# EAGLE design PowerPCB (EAGLE 9.4.2)
Assembly variants: basic, pinout

## Sheet 1 of 2: DC-DC converters
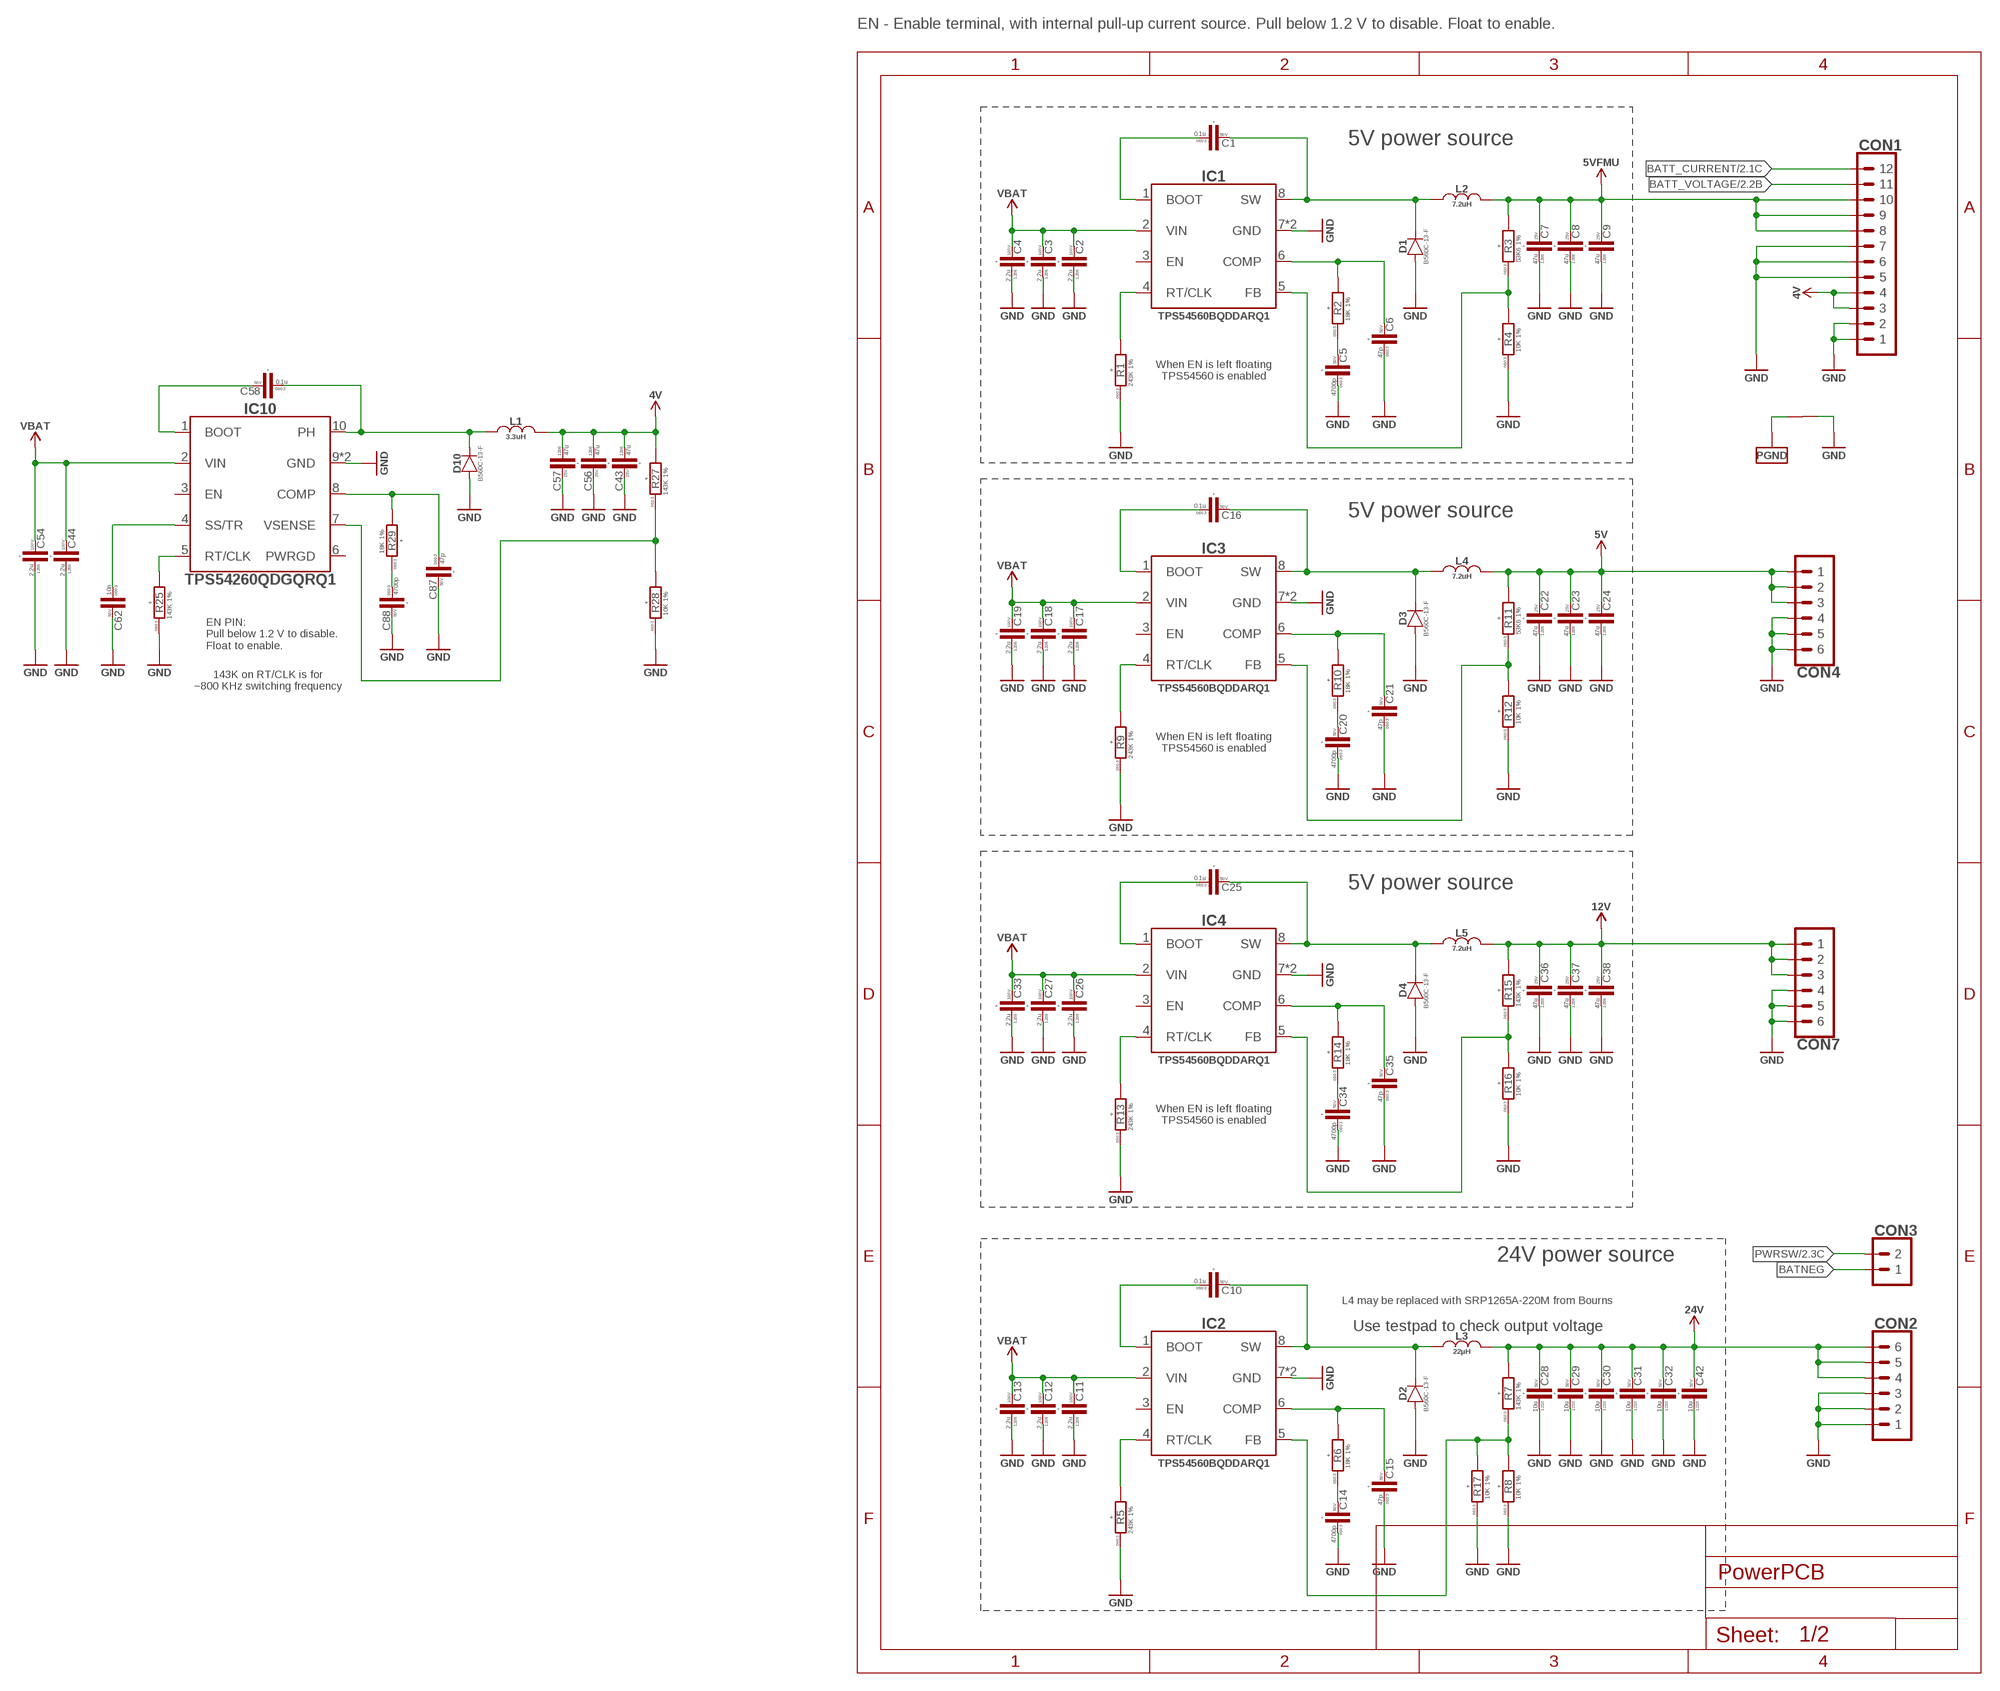
[diagram p0: schematic, sheet 1]

### Parts
C1  0.1u  C-0603  [C0603]
C2  2.2u  C-1206  [C1206]
C3  2.2u  C-1206  [C1206]
C4  2.2u  C-1206  [C1206]
C5  4700p  C-0603  [C0603]
C6  47p  C-0603  [C0603]
C7  47u  C-1206  [C1206]
C8  47u  C-1206  [C1206]
C9  47u  C-1206  [C1206]
C10  0.1u  C-0603  [C0603]
C11  2.2u  C-1206  [C1206]
C12  2.2u  C-1206  [C1206]
C13  2.2u  C-1206  [C1206]
C14  4700p  C-0603  [C0603]
C15  47p  C-0603  [C0603]
C16  0.1u  C-0603  [C0603]
C17  2.2u  C-1206  [C1206]
C18  2.2u  C-1206  [C1206]
C19  2.2u  C-1206  [C1206]
C20  4700p  C-0603  [C0603]
C21  47p  C-0603  [C0603]
C22  47u  C-1206  [C1206]
C23  47u  C-1206  [C1206]
C24  47u  C-1206  [C1206]
C25  0.1u  C-0603  [C0603]
C26  2.2u  C-1206  [C1206]
C27  2.2u  C-1206  [C1206]
C28  10u  C-1210  [C1210]
C29  10u  C-1210  [C1210]
C30  10u  C-1210  [C1210]
C31  10u  C-1210  [C1210]
C32  10u  C-1210  [C1210]
C33  2.2u  C-1206  [C1206]
C34  4700p  C-0603  [C0603]
C35  47p  C-0603  [C0603]
C36  47u  C-1206  [C1206]
C37  47u  C-1206  [C1206]
C38  47u  C-1206  [C1206]
C42  10u  C-1210  [C1210]
C43  47u  C-1206  [C1206]
C44  2.2u  C-1206  [C1206]
C54  2.2u  C-1206  [C1206]
C56  47u  C-1206  [C1206]
C57  47u  C-1206  [C1206]
C58  0.1u  C-0603  [C0603]
C62  10n  C-0603  [C0603]
C87  47p  C-0603  [C0603]
C88  4700p  C-0603  [C0603]
CON1  PINHEAD_1X12-2.54-FEMALE  [1X12-PTH-2.54-FEMALE]
CON2  PINHEAD_1X06-2.54-FEMALE  [1X06-PTH-2.54-FEMALE]
CON3  PINHEAD_1X02-2.54-FEMALE  [1X02-PTH-2.54-FEMALE]
CON4  PINHEAD_1X06-2.54-FEMALE  [1X06-PTH-2.54-FEMALE]
CON7  PINHEAD_1X06-2.54-FEMALE  [1X06-PTH-2.54-FEMALE]
D1  B560C  [DO-214AB(SMC)]
D2  B560C  [DO-214AB(SMC)]
D3  B560C  [DO-214AB(SMC)]
D4  B560C  [DO-214AB(SMC)]
D10  B560C  [DO-214AB(SMC)]
IC1  TPS54560B  [SOIC8-POWERPAD]
IC2  TPS54560B  [SOIC8-POWERPAD]
IC3  TPS54560B  [SOIC8-POWERPAD]
IC4  TPS54560B  [SOIC8-POWERPAD]
IC10  TPS54260  [MSOP10]
J1  CONNECTION-7MM  [CONNECTION_7MM]
L1  3.3uH  3.3µH-IHLP-202BZ  [IHLP-2020BZ-01]
L2  7.2uH  7.2µH-1064  [1064]
L3  22µH  22µH-SRP1265A  [SRP1265A]
L4  7.2uH  7.2µH-1064  [1064]
L5  7.2uH  7.2µH-1064  [1064]
R1  243K  R-1%-0603  [R0603]
R2  18K  R-1%-0603  [R0603]
R3  53K6  R-1%-0603  [R0603]
R4  10K  R-1%-0603  [R0603]
R5  243K  R-1%-0603  [R0603]
R6  18K  R-1%-0603  [R0603]
R7  143K  R-1%-0603  [R0603]
R8  10K  R-1%-0603  [R0603]
R9  243K  R-1%-0603  [R0603]
R10  18K  R-1%-0603  [R0603]
R11  53K6  R-1%-0603  [R0603]
R12  10K  R-1%-0603  [R0603]
R13  243K  R-1%-0603  [R0603]
R14  18K  R-1%-0603  [R0603]
R15  143K  R-1%-0603  [R0603]
R16  10K  R-1%-0603  [R0603]
R17  10K  R-1%-0603  [R0603]
R25  143K  R-1%-0603  [R0603]
R27  143K  R-1%-0603  [R0603]
R28  10K  R-1%-0603  [R0603]
R29  18K  R-1%-0603  [R0603]

### Nets
5VFMU: C7.P$2 C8.P$2 C9.P$2 CON1.8 CON1.9 CON1.10 L2.2 R3.2 ; also sheet 2
BATNEG: CON3.1 ; also sheet 2
BATT_CURRENT: CON1.12 ; also sheet 2
BATT_VOLTAGE: CON1.11 ; also sheet 2
BOOT: C58.2 IC10.1(BOOT)
BOOT1: C1.1 IC1.1(BOOT)
BOOT2: C16.1 IC3.1(BOOT)
BOOT3: C25.1 IC4.1(BOOT)
GND: C2.P$1 C3.P$1 C4.P$1 C5.1 C6.1 C7.P$1 C8.P$1 C9.P$1 C11.P$1 C12.P$1 C13.P$1 C14.1 C15.1 C17.P$1 C18.P$1 C19.P$1 C20.1 C21.1 C22.P$1 C23.P$1 C24.P$1 C26.P$1 C27.P$1 C28.1 C29.1 C30.1 C31.1 C32.1 C33.P$1 C34.1 C35.1 C36.P$1 C37.P$1 C38.P$1 C42.1 C43.P$2 C44.P$1 C54.P$1 C56.P$2 C57.P$2 C62.2 C87.2 C88.2 CON1.1 CON1.2 CON1.5 CON1.6 CON1.7 CON2.1 CON2.2 CON2.3 CON4.4 CON4.5 CON4.6 CON7.4 CON7.5 CON7.6 D1.A D2.A D3.A D4.A D10.A IC1.7(GND) IC1.P$1(GND) IC2.7(GND) IC2.P$1(GND) IC3.7(GND) IC3.P$1(GND) IC4.7(GND) IC4.P$1(GND) IC10.9(GND) IC10.EP(GND) J1.2 R1.1 R4.1 R5.1 R8.1 R9.1 R12.1 R13.1 R16.1 R17.1 R25.1 R28.1 ; also sheet 2
N$1: IC1.4(RT/CLK) R1.2
N$2: IC3.4(RT/CLK) R9.2
N$3: C6.2 IC1.6(COMP) R2.2
N$4: C5.2 R2.1
N$5: IC1.5(FB) R3.1 R4.2
N$6: C21.2 IC3.6(COMP) R10.2
N$7: C10.1 IC2.1(BOOT)
N$8: C10.2 D2.C IC2.8(SW) L3.1
N$9: IC2.4(RT/CLK) R5.2
N$10: C15.2 IC2.6(COMP) R6.2
N$11: C14.2 R6.1
N$12: IC2.5(FB) R7.1 R8.2 R17.2
N$13: C20.2 R10.1
N$14: IC4.4(RT/CLK) R13.2
N$15: IC3.5(FB) R11.1 R12.2
N$16: C35.2 IC4.6(COMP) R14.2
N$17: C34.2 R14.1
N$18: IC4.5(FB) R15.1 R16.2
N$20: C62.1 IC10.4(SS/TR)
N$38: C87.1 IC10.8(COMP) R29.2
N$39: IC10.5(RT/CLK) R25.2
N$50: C88.1 R29.1
PGND: J1.1 ; also sheet 2
PH: C58.1 D10.C IC10.10(PH) L1.P$1
PWRSW: CON3.2 ; also sheet 2
SW1: C1.2 D1.C IC1.8(SW) L2.1
SW2: C16.2 D3.C IC3.8(SW) L4.1
SW3: C25.2 D4.C IC4.8(SW) L5.1
VBAT [HV]: C2.P$2 C3.P$2 C4.P$2 C11.P$2 C12.P$2 C13.P$2 C17.P$2 C18.P$2 C19.P$2 C26.P$2 C27.P$2 C33.P$2 C44.P$2 C54.P$2 IC1.2(VIN) IC2.2(VIN) IC3.2(VIN) IC4.2(VIN) IC10.2(VIN) ; also sheet 2
VDD_4V: C43.P$1 C56.P$1 C57.P$1 CON1.3 CON1.4 L1.P$2 R27.2 ; supply symbol labelled 4V
VDD_5V: C22.P$2 C23.P$2 C24.P$2 CON4.1 CON4.2 CON4.3 L4.2 R11.2 ; supply symbol labelled 5V
VDD_12V: C36.P$2 C37.P$2 C38.P$2 CON7.1 CON7.2 CON7.3 L5.2 R15.2 ; supply symbol labelled 12V
VDD_24V: C28.2 C29.2 C30.2 C31.2 C32.2 C42.2 CON2.4 CON2.5 CON2.6 L3.2 R7.2 ; supply symbol labelled 24V
VSENSE: IC10.7(VSENSE) R27.1 R28.2
Unconnected: IC1.3(EN) IC2.3(EN) IC3.3(EN) IC4.3(EN) IC10.3(EN) IC10.6(PWRGD)

### Notes on the sheet
- EN - Enable terminal, with internal pull-up current source. Pull below 1.2 V to disable. Float to enable.
- 5V power source
- When EN is left floating
  TPS54560 is enabled
- 5V power source
- EN PIN:
  Pull below 1.2 V to disable. 
  Float to enable.
- 143K on RT/CLK is for
  ~800 KHz switching frequency
- When EN is left floating
  TPS54560 is enabled
- 5V power source
- When EN is left floating
  TPS54560 is enabled
- 24V power source
- L4 may be replaced with SRP1265A-220M from Bourns
- Use testpad to check output voltage

## Sheet 2 of 2: ESC and battery power connections
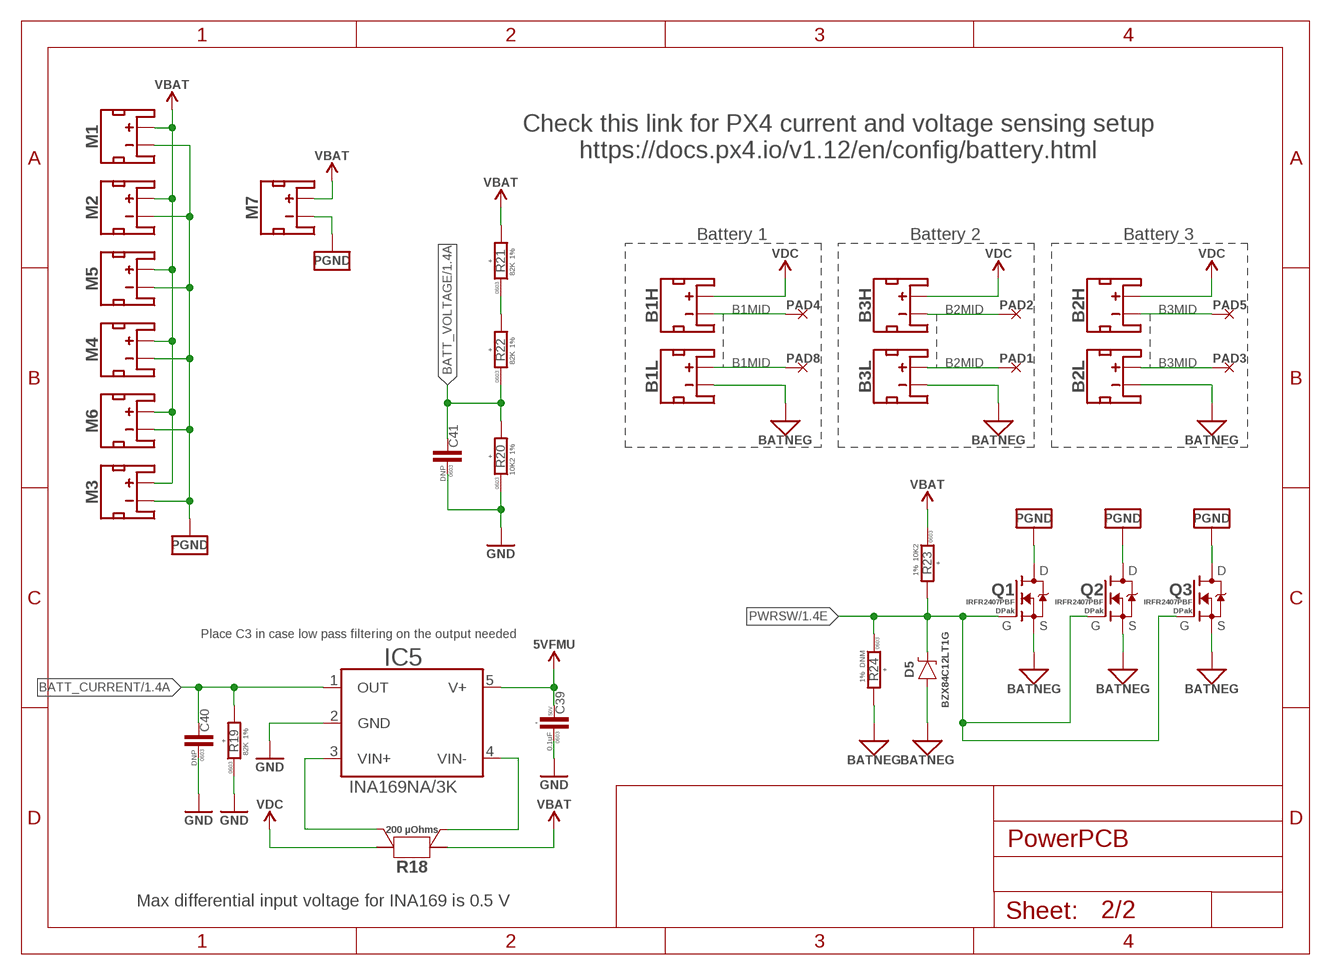
[diagram p1: schematic, sheet 2]

### Parts
B1H  BATTERY_CON-XT60PW-M  [XT60PW-M]
B1L  BATTERY_CON-XT60PW-M  [XT60PW-M]
B2H  BATTERY_CON-XT60PW-M  [XT60PW-M]
B2L  BATTERY_CON-XT60PW-M  [XT60PW-M]
B3H  BATTERY_CON-XT60PW-M  [XT60PW-M]
B3L  BATTERY_CON-XT60PW-M  [XT60PW-M]
C39  0.1uF  C-0603  [C0603]  (not fitted in variant pinout)
C40  DNP  C-0603  [C0603]  (not fitted in variant basic)  (not fitted in variant pinout)
C41  DNP  C-0603  [C0603]  (not fitted in variant basic)  (not fitted in variant pinout)
D5  BZX84C12  [SOT23]
IC5  INA169  [SOT23-5]  (not fitted in variant pinout)
M1  BATTERY_CON-XT30-RA  [XT30-RA]
M2  BATTERY_CON-XT30-RA  [XT30-RA]
M3  BATTERY_CON-XT30-RA  [XT30-RA]
M4  BATTERY_CON-XT30-RA  [XT30-RA]
M5  BATTERY_CON-XT30-RA  [XT30-RA]
M6  BATTERY_CON-XT30-RA  [XT30-RA]
M7  BATTERY_CON-XT30-RA  [XT30-RA]
PAD1  PAD-10X4  [10X4]  (not fitted in variant basic)  (not fitted in variant pinout)
PAD2  PAD-10X4  [10X4]  (not fitted in variant basic)  (not fitted in variant pinout)
PAD3  PAD-10X4  [10X4]  (not fitted in variant basic)  (not fitted in variant pinout)
PAD4  PAD-10X4  [10X4]  (not fitted in variant basic)  (not fitted in variant pinout)
PAD5  PAD-10X4  [10X4]  (not fitted in variant basic)  (not fitted in variant pinout)
PAD8  PAD-10X4  [10X4]  (not fitted in variant basic)  (not fitted in variant pinout)
Q1  IRFR2407PBF  [D-PAK]
Q2  IRFR2407PBF  [D-PAK]
Q3  IRFR2407PBF  [D-PAK]
R18  200 µOhms  CURRENT_SHUNT_KELVIN-0.0002R-3920-KELVIN  [R3920-KELVIN]  (not fitted in variant pinout)
R19  82K  R-1%-0603  [R0603]  (not fitted in variant pinout)
R20  10K2  R-1%-0603  [R0603]  (not fitted in variant pinout)
R21  82K  R-1%-0603  [R0603]  (not fitted in variant pinout)
R22  82K  R-1%-0603  [R0603]  (not fitted in variant pinout)
R23  10K2  R-1%-0603  [R0603]
R24  DNM  R-1%-0603  [R0603]

### Nets
5VFMU: C39.2 IC5.5(V+) ; also sheet 1
B1MID: B1H.- B1L.+ PAD4.P$1 PAD8.P$1
B2MID: B3H.- B3L.+ PAD1.P$1 PAD2.P$1
B3MID: B2H.- B2L.+ PAD3.P$1 PAD5.P$1
BATNEG: B1L.- B2L.- B3L.- D5.1(A) Q1.S Q2.S Q3.S R24.2 ; also sheet 1
BATT_CURRENT: C40.2 IC5.1(OUT) R19.2 ; also sheet 1
BATT_VOLTAGE: C41.2 R20.2 R22.1 ; also sheet 1
GND: C39.1 C40.1 C41.1 IC5.2(GND) R19.1 R20.1 ; also sheet 1
N$19: IC5.4(VIN-) R18.S2
N$21: IC5.3(VIN+) R18.S1
N$22: R21.1 R22.2
PGND: M1.- M2.- M3.- M4.- M5.- M6.- M7.- Q1.D Q2.D Q3.D ; also sheet 1
PWRSW: D5.3(C) Q1.G Q2.G Q3.G R23.2 R24.1 ; also sheet 1
VBAT [HV]: M1.+ M2.+ M3.+ M4.+ M5.+ M6.+ M7.+ R18.2 R18.22 R21.2 R23.1 ; also sheet 1
VDC [HV]: B1H.+ B2H.+ B3H.+ R18.1 R18.11
Unconnected: B1H.P$3(PAD1) B1H.P$4(PAD2) B1L.P$3(PAD1) B1L.P$4(PAD2) B2H.P$3(PAD1) B2H.P$4(PAD2) B2L.P$3(PAD1) B2L.P$4(PAD2) B3H.P$3(PAD1) B3H.P$4(PAD2) B3L.P$3(PAD1) B3L.P$4(PAD2) M1.P$3(PAD1) M1.P$4(PAD2) M2.P$3(PAD1) M2.P$4(PAD2) M3.P$3(PAD1) M3.P$4(PAD2) M4.P$3(PAD1) M4.P$4(PAD2) M5.P$3(PAD1) M5.P$4(PAD2) M6.P$3(PAD1) M6.P$4(PAD2) M7.P$3(PAD1) M7.P$4(PAD2)

### Notes on the sheet
- Check this link for PX4 current and voltage sensing setup
  https://docs.px4.io/v1.12/en/config/battery.html
- Battery 1 | Battery 2 | Battery 3
- Place C3 in case low pass filtering on the output needed
- Max differential input voltage for INA169 is 0.5 V

## Library data of the parts
B1H B1L B2H B2L B3H B3L = Connectors:BATTERY_CON
C1 C10 C16 C25 C39 C58 = rc:C; ALLOCATED: +; LCSC#: C14663; MANF: YAGEO; MANF#: CC0603KRX7R9BB104; PACKAGE: 0603; VOLTAGE: 50V
C2-C4 C11-C13 C17-C19 C26 C27 C33 C44 C54 = rc:C; ALLOCATED: +; LCSC#: C170101; MANF: Samsung Electro-Mechanics; MANF#: CL31B225KCHSNNE; PACKAGE: 1206; VOLTAGE: 100V
C5 C14 C20 C34 C88 = rc:C; ALLOCATED: +; LCSC#: C106218; MANF: YAGEO; MANF#: CC0603KRX7R9BB472; PACKAGE: 0603; VOLTAGE: 50V
C6 C15 C21 C35 C87 = rc:C; ALLOCATED: +; LCSC#: C1671; MANF: Samsung Electro-Mechanics; MANF#: CL10C470JB8NNNC; PACKAGE: 0603; VOLTAGE: 50V
C7-C9 C22-C24 C36-C38 C43 C56 C57 = rc:C; ALLOCATED: +; LCSC#: C403725; MANF: Murata Electronics; MANF#: GRM31CR61E476ME44L; PACKAGE: 1206; VOLTAGE: 25V
C28-C32 C42 = rc:C; ALLOCATED: +; LCSC#: C77102; MANF: Murata Electronics; MANF#: GRM32ER71H106K; PACKAGE: 1210; VOLTAGE: 50V
C40 C41 = rc:C; PACKAGE: 0603
C62 = rc:C; PACKAGE: 0603; VOLTAGE: 50V
CON1 = pinhead:PINHEAD_1X12
CON2 CON4 CON7 = pinhead:PINHEAD_1X06: pinheader 6P
CON3 = pinhead:PINHEAD_1X02: pinheader 2P
D1-D4 D10 = Diodes:B560C: 60V 700mV@5A 5A SMC(DO-214AB) Schottky Barrier Diodes (SBD) ROHS; LCSC#: C85100; MANF: Diodes Incorporated; MANF#: B560C-13-F
D5 = Diodes:BZX84C: Zener Diode 250mW ±5% Surface Mount SOT-23-3 (TO-236); DIGIKEY#: BZX84C12LT1GOSTR-ND; LCSC#: C82475; MANF: ON Semiconductor; MANF#: BZX84C12LT1G
IC1-IC4 = dc-dc:TPS54560B: Switching Voltage Regulators 4.5V to 60V Input, 5A, Step-Down DC-DC Converter with Eco-mode™ 8-SO PowerPAD -40 to 125 Datasheet <https://www.ti.com/lit/ds/symlink/tps54560b.pdf?ts=1655463669009>; LCSC#: C1355654; MANF: Texas Instruments; MANF#: TPS54560BQDDARQ1
IC5 = misc:INA169: High-Side Measurement Current Shunt Monitor; LCSC#: C44322; MANF: Texas Instruments; MANF#: INA169NA/3K
IC10 = dc-dc:TPS54260: IC REG BUCK ADJ 2.5A 10MSOP Datasheet <http://www.ti.com/lit/ds/slvsa86c/slvsa86c.pdf>; DIGIKEY#: 296-28183-1-ND; MANF: Texas Instruments; MANF#: TPS54260QDGQRQ1
J1 = misc:CONNECTION
L1 = power_inductors:3.3µH; LCSC#: C844988; MANF: Vishay Precision Group; MANF#: IHLP2020BZER3R3M01
L2 L4 L5 = power_inductors:7.2µH; DC_RESISTANCE: 11.3 mOhm; MANF: Wurth Elektronik; MANF#: 7447798720; RATED_CURRENT: 7.9A
L3 = power_inductors:22µH: Wirewound Inductor; LCSC#: C2041465; MANF: Bourns; MANF#: SRP1265A-220M; RATED_CURRENT: 9 A
M1-M7 = Connectors:BATTERY_CON; LINK: https://www.tme.eu/en/details/xt30pw-m/dc-power-connectors/amass/; MANF: AMASS; MANF#: XT30PW-M
PAD1-PAD5 PAD8 = PADS:PAD
Q1-Q3 = mosfet:IRFR2407PBF: N-Channel 75V 42A power MOSFET, Rdson = 0.026 Ohm; LCSC#: C40514; MANF: International Rectifier; MANF#: IRFR2407PBF; PACKAGE: DPak
R1 R5 R9 R13 = rc:R; ALLOCATED: +; LCSC#: C23351; MANF: UNI-ROYAL(Uniroyal Elec); MANF#: 0603WAF2433T5E; PACKAGE: 0603; TOLERANCE: 1%
R2 R6 R10 R14 R29 = rc:R; ALLOCATED: +; LCSC#: C25810; MANF: UNI-ROYAL; MANF#: 0603WAF1802T5E; PACKAGE: 0603; TOLERANCE: 1%
R3 R11 R15 = rc:R; ALLOCATED: +; LCSC#: C23074; MANF: UNI-ROYAL(Uniroyal Elec); MANF#: 0603WAF5362T5E; PACKAGE: 0603; TOLERANCE: 1%
R4 R8 R12 R16 R17 R28 = rc:R; ALLOCATED: +; LCSC#: C160601; MANF: YAGEO; MANF#: RT0603FRD0710KL; PACKAGE: 0603; TOLERANCE: 1%
R7 R25 R27 = rc:R; ALLOCATED: +; LCSC#: C22877; MANF: UNI-ROYAL(Uniroyal Elec); MANF#: 0603WAF1433T5E; PACKAGE: 0603; TOLERANCE: 1%
R18 = SHUNT_RESISTORS:CURRENT_SHUNT_KELVIN; DIGIKEY#: CSS2H-3920R-L200FCT-ND; MANF: Bourns Inc; MANF#: CSS2H-3920R-L200FCT-ND; OPERATING_TEMP: -55°C ~ 170°C; PACKAGE: 3920; POWER: 12W; TC: ±50ppm/°C; TOLERANCE: ±1%
R19 R21 R22 = rc:R; ALLOCATED: +; LCSC#: C23254; MANF: UNI-ROYAL(Uniroyal Elec); MANF#: 0603WAF8202T5E; PACKAGE: 0603; TOLERANCE: 1%
R20 R23 R24 = rc:R; ALLOCATED: +; LCSC#: C22772; MANF: UNI-ROYAL(Uniroyal Elec); MANF#: 0603WAF1022T5E; PACKAGE: 0603; TOLERANCE: 1%

## Net classes
1 HV: clearance 0.3 mm to class 0, clearance 0.3 mm

## Board
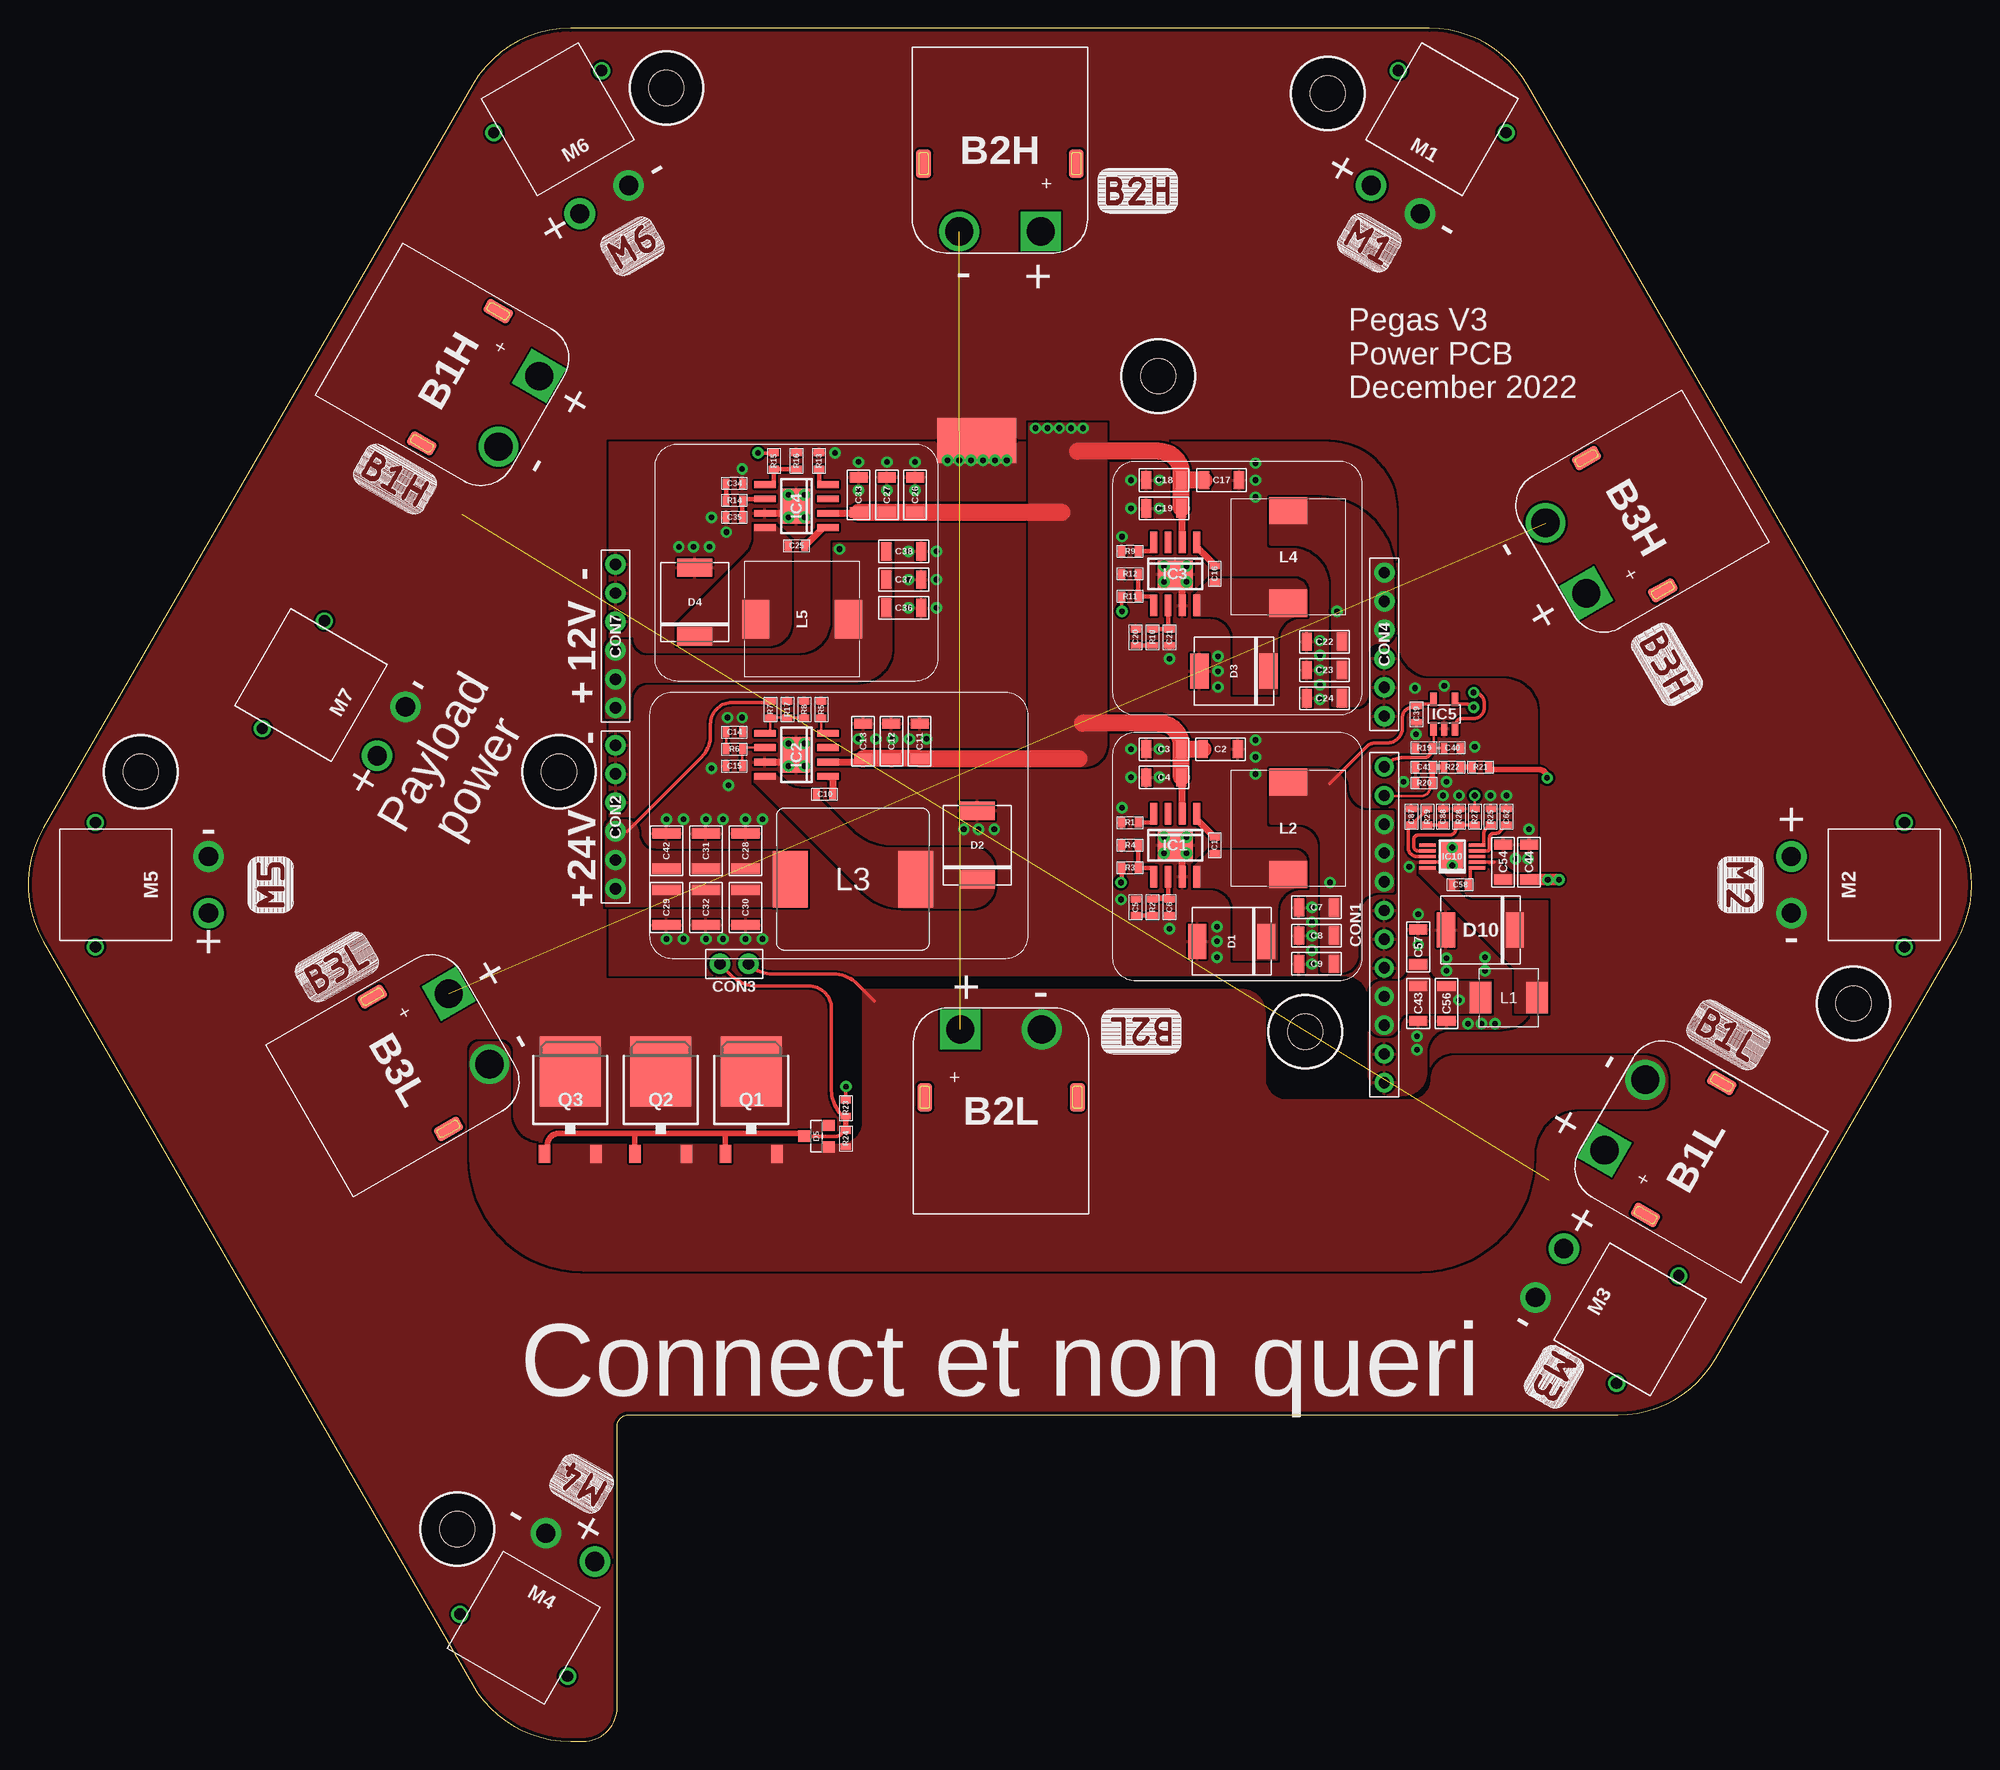
[diagram p2: board, top side]
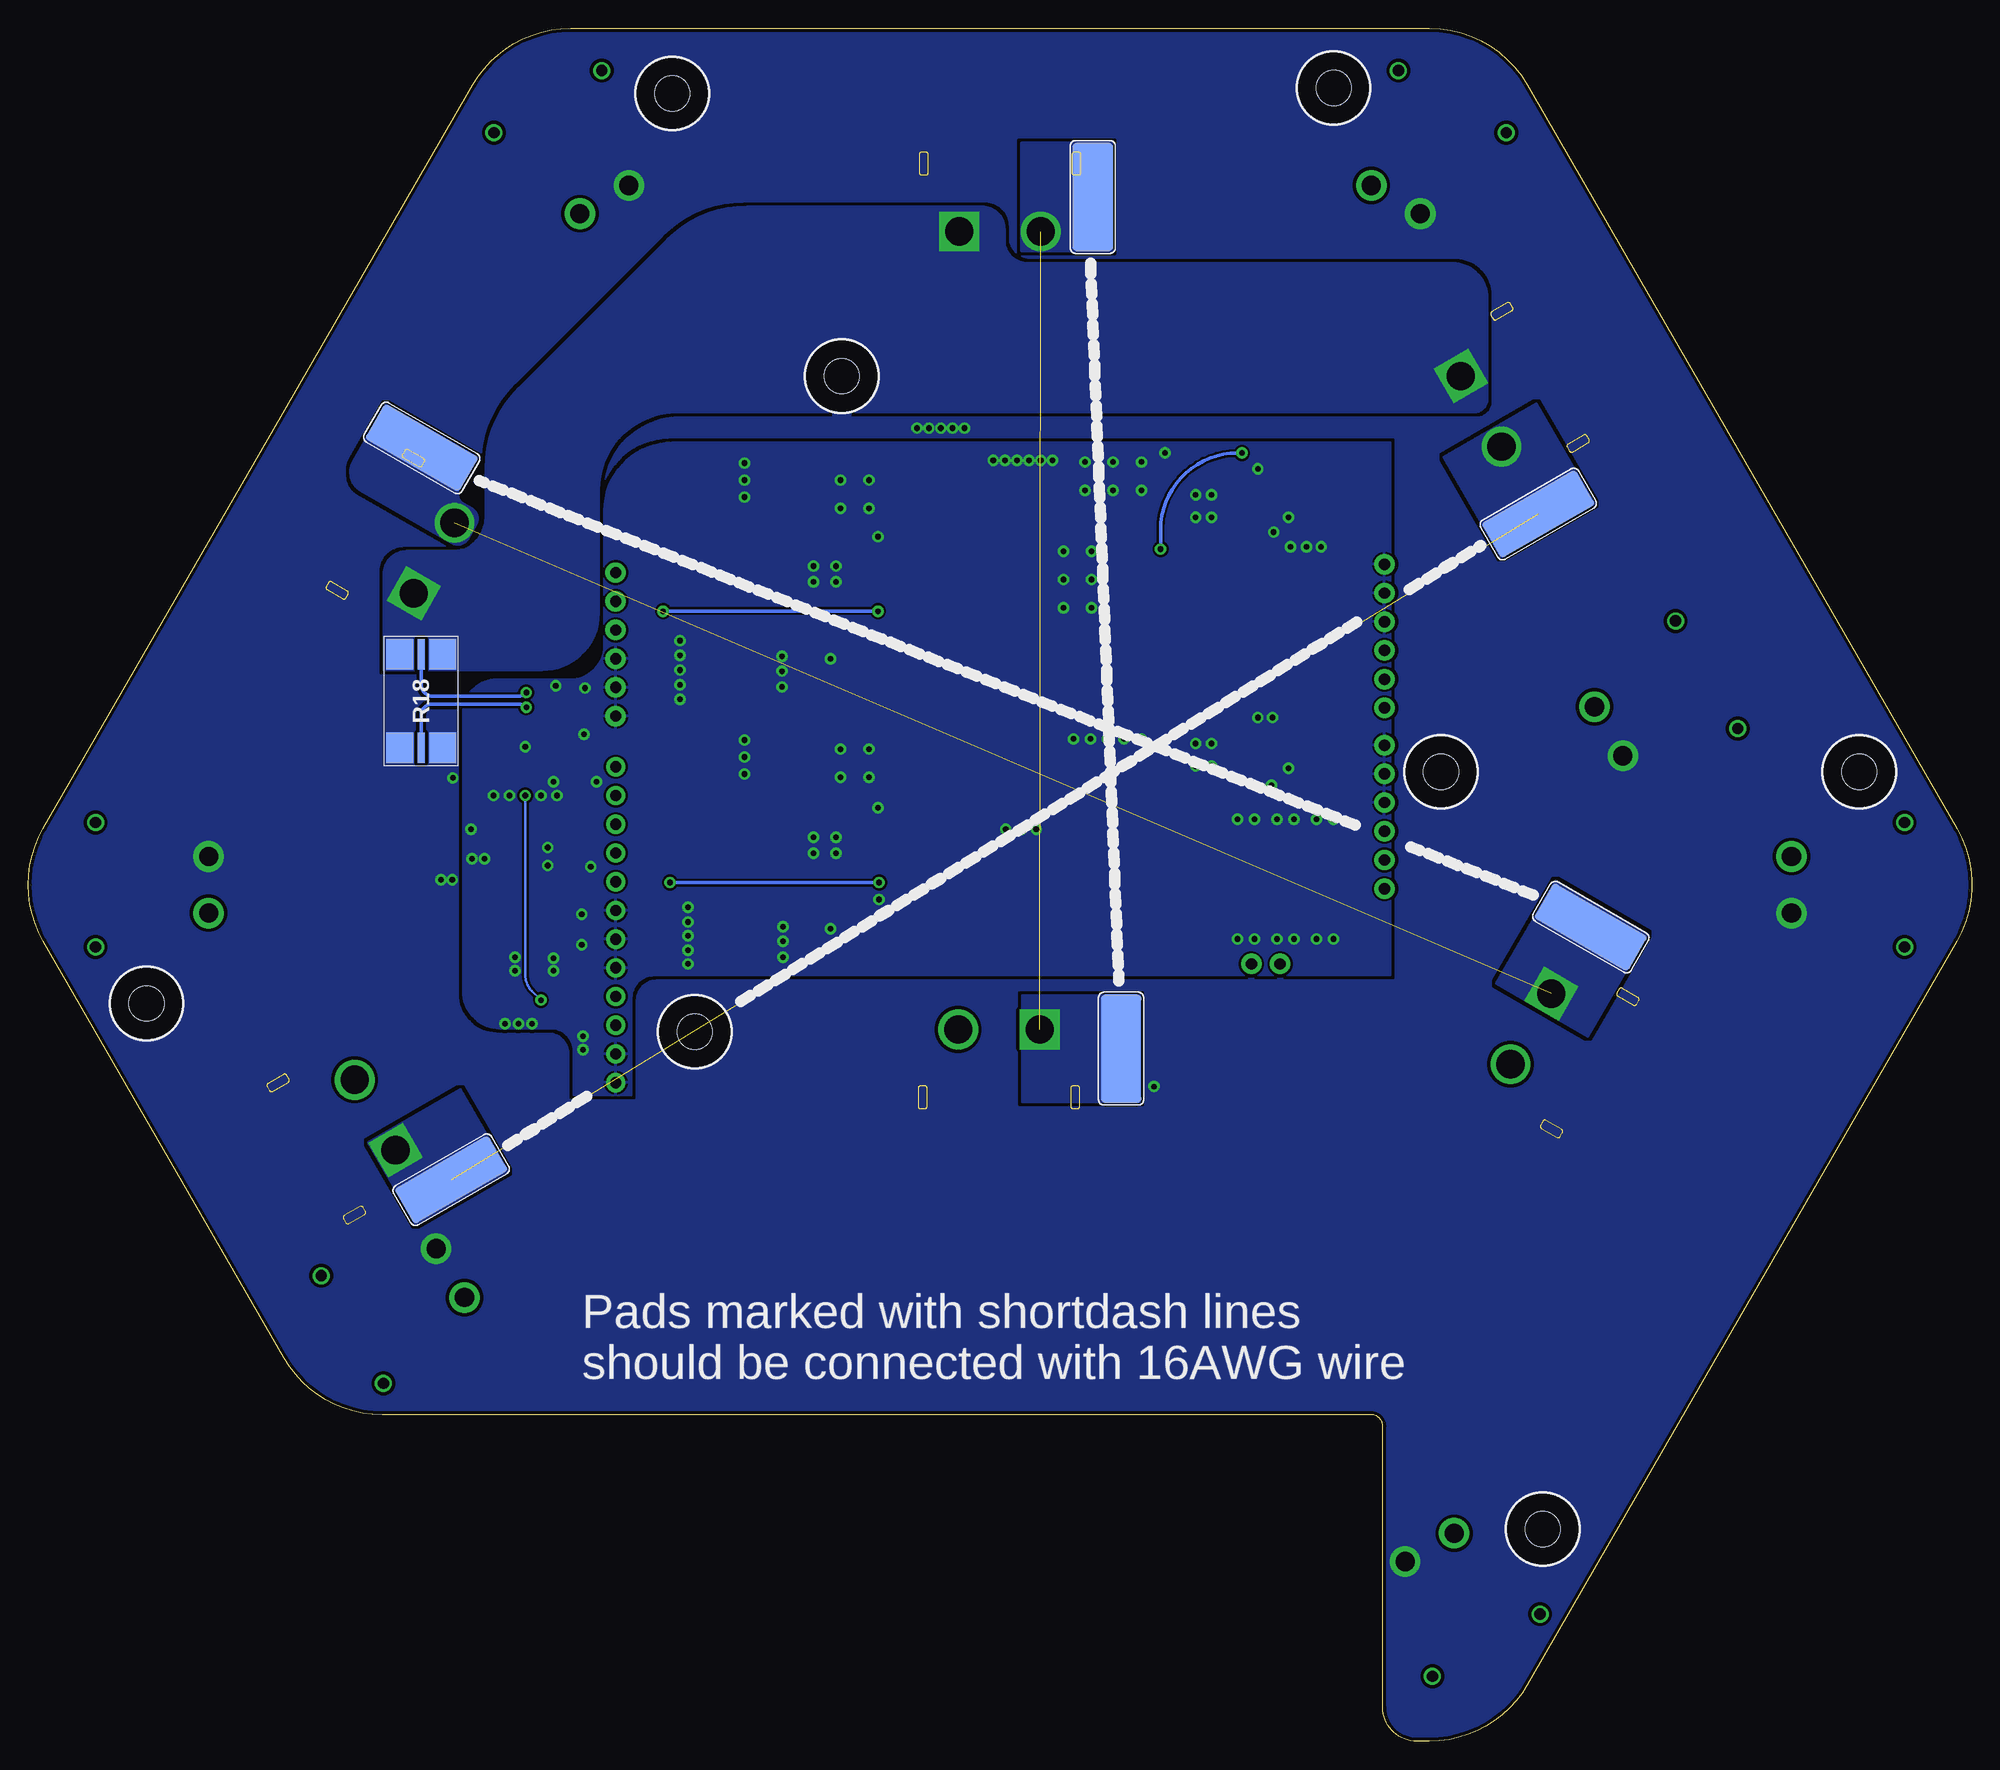
[diagram p3: board, bottom side, seen from below]

Size 171.89 x 151.55 mm. Coordinates in mm from the lower left corner, seen from the top.
Outline: 47.97,0 49.09,0 arc90 52.09,3 52.09,27.88 arc-90 53.09,28.88 140.59,28.88 arc60 149.25,33.88 170.55,70.78 arc60 170.55,80.78 132.58,146.55 arc60 123.92,151.55 47.97,151.55 arc60 39.3,146.55 1.33,80.78 arc60 1.33,70.78 39.3,5 arc60 47.97,0
Copper layers (1*16): Top 0.035mm / dielectric 1.5mm / Bottom 0.035mm
Design rules "JLCPCB 4 layer *": minimum track width 0.15mm, minimum drill 0.2mm, track to track 0.2mm, track to pad 0.2mm, pad to pad 0.2mm, via to via 0.2mm, smd to smd 0.2mm, copper to edge 0.3mm, drill to drill 0.2mm, minimum pad ring 0.125mm, minimum via ring 0.125mm, stop-mask expansion 1mil, vias tented up to drill 0.5mm, thermal gap 8mil
Holes 3.1 mm at 9.94,85.78 37.94,18.78 114.94,145.78 161.44,65.28 56.44,146.28 99.94,120.78 46.94,85.78 112.94,62.78
tRestrict: area 6.7,82.5 to 13.2,89; area 34.7,15.5 to 41.2,22; area 111.7,142.5 to 118.2,149; area 158.2,62 to 164.7,68.5; area 53.2,143 to 59.7,149.5; area 96.7,117.5 to 103.2,124; area 43.7,82.5 to 50.2,89; area 109.7,59.5 to 116.2,66
bRestrict: area 6.7,82.5 to 13.2,89; area 34.7,15.5 to 41.2,22; area 111.7,142.5 to 118.2,149; area 158.2,62 to 164.7,68.5; area 53.2,143 to 59.7,149.5; area 96.7,117.5 to 103.2,124; area 43.7,82.5 to 50.2,89; area 109.7,59.5 to 116.2,66

### Footprints (pad centres in the part's own frame; a part is rotated, then mirrored left to right if it is on the bottom)
XT60PW-M = drill 2.5 square: + 3.6,-7.2 | drill 2.5: - -3.6,-7.2 | smd 1.3 x 2.5: P$3 -6.75,-1.2; P$4 6.75,-1.2
C0603 = smd 0.6 x 0.9: 1 -0.725,0; 2 0.725,0
C1206 = smd 0.9 x 1.6: P$1 -1.55,0; P$2 1.55,0
C1210 = smd 0.9 x 2.5: 1 -1.55,0; 2 1.55,0
1X12-PTH-2.54-FEMALE = drill 1 pad 1.7: 1 -13.97,0; 2 -11.43,0; 3 -8.89,0; 4 -6.35,0; 5 -3.81,0; 6 -1.27,0; 7 1.27,0; 8 3.81,0; 9 6.35,0; 10 8.89,0; 11 11.43,0; 12 13.97,0
1X06-PTH-2.54-FEMALE = drill 1 pad 1.8: 1 -6.35,0; 2 -3.81,0; 3 -1.27,0; 4 1.27,0; 5 3.81,0; 6 6.35,0
1X02-PTH-2.54-FEMALE = drill 1 pad 1.8: 1 -1.27,0; 2 1.27,0
DO-214AB(SMC) = smd 1.6 x 3.1: A 3.05,0; C -3.05,0
SOT23 = smd 1 x 1: 1 1.1,-0.95; 2 1.1,0.95; 3 -1.1,0
SOIC8-POWERPAD = smd 0.6 x 1.9: 1 -1.905,-2.78; 2 -0.635,-2.78; 3 0.635,-2.78; 4 1.905,-2.78; 5 1.905,2.78; 6 0.635,2.78; 7 -0.635,2.78; 8 -1.905,2.78 | smd 3.1 x 2.4: P$1 0,0
SOT23-5 = smd 1.2 x 0.55: 1 1.3,-0.95; 2 1.3,0; 3 1.3,0.95; 4 -1.3,0.95; 5 -1.3,-0.95
MSOP10 = smd 1.45 x 0.3: 1 -2.2,1; 2 -2.2,0.5; 3 -2.2,0; 4 -2.2,-0.5; 5 -2.2,-1; 6 2.2,-1; 7 2.2,-0.5; 8 2.2,0; 9 2.2,0.5; 10 2.2,1 | smd 1.9 x 2.6: EP 0,0
CONNECTION_7MM = smd 2 x 7: 1 -1,0; 2 1,0
IHLP-2020BZ-01 = smd 1.9 x 2.8: P$1 -2.5,0; P$2 2.5,0
1064 = smd 3.4 x 2.4: 1 0,-4.1; 2 0,4.1
SRP1265A = smd 3.1 x 5: 1 -5.55,0; 2 5.55,0
XT30-RA = drill 1.7 pad 2.7: + -2.5,0; - 2.5,0 | drill 1 pad 1.5: P$3 -5.5,10; P$4 5.5,10
10X4 = smd 3.6 x 9.6: P$1 0,0
D-PAK = smd 5.4 x 6.2: D 0,2.5 | smd 1 x 1.6: G -2.28,-4.8; S 2.28,-4.8
R0603 = smd 0.6 x 0.9: 1 -0.725,0; 2 0.725,0
R3920-KELVIN = smd 2.7 x 2.4: 1 -4.15,1.9; 2 4.15,1.9; 11 -4.15,-1.9; 22 4.15,-1.9 | smd 2.7 x 0.6: S1 -4.15,0; S2 4.15,0

### Placement (x,y rotation side)
B1H  37.15,121.27 60 top
B1L  147.46,51.8 240 top
B2H  85.94,140.78 0 top
B2L  86.04,55.78 180 top
B3H  142.23,108.28 300 top
B3L  32.75,59.43 120 top
C1  104.94,79.28 270 top
C2  105.44,87.78 180 top
C3  100.44,87.78 0 top
C4  100.44,85.28 0 top
C5  97.94,73.78 270 top
C6  100.94,73.78 90 top
C7  113.94,73.78 0 top
C8  113.94,71.28 0 top
C9  113.94,68.78 0 top
C10  70.44,83.78 180 top
C11  78.84,88.48 270 top
C12  76.34,88.48 270 top
C13  73.84,88.48 270 top
C14  62.44,89.28 180 top
C15  62.44,86.28 0 top
C16  104.94,103.28 270 top
C17  105.54,111.58 180 top
C18  100.44,111.58 0 top
C19  100.44,109.08 0 top
C20  97.94,97.68 270 top
C21  100.94,97.68 90 top
C22  114.64,97.28 0 top
C23  114.64,94.78 0 top
C24  114.64,92.28 0 top
C25  67.94,105.78 180 top
C26  78.44,110.28 270 top
C27  75.94,110.28 270 top
C28  63.44,78.78 270 top
C29  56.44,73.78 90 top
C30  63.44,73.78 90 top
C31  59.94,78.78 270 top
C32  59.94,73.78 90 top
C33  73.44,110.28 270 top
C34  62.44,111.28 180 top
C35  62.44,108.28 0 top
C36  77.44,100.28 180 top
C37  77.44,102.78 180 top
C38  77.44,105.28 180 top
C39  122.79,90.88 90 top
C40  125.94,87.88 180 top
C41  123.44,86.18 0 top
C42  56.44,78.78 270 top
C43  122.94,65.28 270 top
C44  132.74,77.78 270 top
C54  130.44,77.78 270 top
C56  125.44,65.28 270 top
C57  122.94,70.28 90 top
C58  126.64,75.78 0 top
C62  130.74,81.78 90 top
C87  122.34,81.78 90 top
C88  125.14,81.78 90 top
CON1  119.94,72.24 90 top
CON2  51.94,81.78 270 top
CON3  62.44,68.78 180 top
CON4  119.94,97.05 270 top
CON7  51.94,97.78 90 top
D1  106.44,70.78 180 top
D2  83.94,79.28 90 top
D3  106.64,94.68 180 top
D4  58.94,100.78 90 top
D5  69.72,53.53 0 top
D10  128.44,71.78 180 top
IC1  101.44,79.28 180 top
IC2  67.94,87.28 90 top
IC3  101.44,103.28 180 top
IC4  67.94,109.28 90 top
IC5  125.24,90.88 270 top
IC10  125.94,78.28 180 top
J1  83.89,115.08 270 top
L1  130.94,65.78 180 top
L2  111.44,80.78 0 top
L3  72.94,76.28 180 top
L4  111.44,104.78 0 top
L5  68.44,99.28 270 top
M1  120.94,136.4 330 top
M2  155.94,75.78 270 top
M3  134.57,41.43 240 top
M4  47.94,17.16 150 top
M5  15.94,75.78 90 top
M6  50.94,136.4 30 top
M7  32.11,89.35 60 top
PAD1  33.69,72.03 240 bottom
PAD2  137.09,114.43 60 bottom
PAD3  75.24,61.28 0 bottom
PAD4  38.34,108.58 300 bottom
PAD5  77.74,136.63 180 bottom
PAD8  134.49,49.68 120 bottom
Q1  63.94,56.78 0 top
Q2  55.94,56.78 0 top
Q3  47.94,56.78 0 top
R1  97.44,81.28 0 top
R2  99.44,73.78 90 top
R3  97.44,77.28 180 top
R4  97.44,79.28 0 top
R5  70.14,91.28 270 top
R6  62.44,87.78 0 top
R7  65.64,91.28 90 top
R8  68.64,91.28 270 top
R9  97.44,105.28 0 top
R10  99.44,97.68 90 top
R11  97.44,101.28 180 top
R12  97.44,103.28 0 top
R13  69.94,113.28 270 top
R14  62.44,109.78 0 top
R15  65.94,113.28 90 top
R16  67.94,113.28 270 top
R17  67.14,91.28 270 top
R18  137.14,92.03 270 bottom
R19  123.44,87.88 0 top
R20  123.44,84.78 0 top
R21  128.44,86.18 0 top
R22  125.94,86.18 0 top
R23  72.32,56.03 270 top
R24  72.32,53.33 270 top
R25  129.34,81.78 270 top
R27  127.94,81.78 90 top
R28  126.54,81.78 270 top
R29  123.74,81.78 90 top

### Tracks (layer width: path | path; a pad name or v marks a point on that pad's centre or on a via)
5VFMU  (via drill 0.5 pad 1)
  Top 0.3: IC5.5 124.29,91.75 122.94,91.75 C39.2 122.64,91.45 122.39,91.45 arc90 121.54,90.6 121.54,89.68 arc-90 120.19,88.33 119.12,88.33 arc45 118.39,88.02 115.09,84.73
  Top 0.4: R3.2 96.72,75.98 v96.64,75.98
  Bottom 0.3: v115.14,75.98 v96.64,75.98
  pour Top (no thermals): 109.94,85.88 109.94,81.28 112.44,81.28 arc-90 114.44,79.28 114.44,68.18 116.04,68.18 arc90 117.44,69.58 117.44,73.28 arc-90 119.44,75.28 120.64,75.28 120.64,82.18 118.44,82.18 arc-90 116.44,84.18 arc90 114.74,85.88
B1MID  (1 unrouted)
  pour Bottom (no thermals): 38.5,118.34 33.39,109.5 41.59,104.77 46.7,113.61
  pour Bottom (no thermals): 133.69,57.68 129.5,50.43 137.63,45.73 141.81,52.99
B2MID  (1 unrouted)
  pour Bottom (no thermals): 36.81,76.12 28.7,71.44 33.95,62.35 42.06,67.04
  pour Bottom (no thermals): 140.27,118.23 132.19,113.57 133.77,110.85 arc-90 133.4,109.48 132.65,109.04 arc90 132.28,107.68 133.04,106.37 arc90 134.4,106 142.49,110.67 arc90 143.17,113.21
B3MID  (1 unrouted)
  pour Bottom (no thermals): 83.99,65.97 73.58,65.97 73.58,56.54 83.99,56.54
  pour Bottom (no thermals): 84.04,131.88 76.04,131.88 76.04,141.38 84.04,141.38
BATNEG
  Top 0.3: CON3.1 63.73,68.76 arc45 65.85,67.88 71.2,67.88 arc-45 73.32,67 74.84,65.48
  pour Top (rank 3, no thermals): 133.12,52.03 133.12,51.78 arc-90 123.02,41.68 49.09,41.68 arc-90 39.09,51.68 39.09,60.98 arc-90 39.94,61.83 41.59,61.83 arc-90 42.59,60.83 42.59,55.38 arc90 45.19,52.78 71.84,52.78 arc90 73.84,54.78 73.84,66.48 107.34,66.48 arc-90 109.34,64.48 109.34,58.68 arc90 111.34,56.68 122.24,56.68 arc90 124.14,58.58 arc-90 126.14,60.58 142.97,60.58 arc-90 144.97,58.58 144.97,58.03 arc-90 142.97,56.03 137.12,56.03 arc90
BATT_CURRENT
  Top 0.2: C40.2 R19.2 124.29,87.88 IC5.1
  Top 0.3: R19.2 124.02,87.73 124.02,87.53 arc-90 123.52,87.03 121.59,87.03 arc45 120.18,86.44 CON1.12
BATT_VOLTAGE
  Top 0.2: R20.2 123.97,84.58 123.97,84.38 arc-90 123.22,83.63 119.98,83.63 CON1.11
  Top 0.5: R22.1 C41.2 R20.2
BOOT
  Top 0.3: IC10.1 127.54,77.28 127.54,76.15 127.37,75.98 C58.2
BOOT1
  Top 0.6: C1.1 104.9,80 103.35,81.56 IC1.1
BOOT2
  Top 0.6: IC3.1 103.35,105.66 104.94,104.06 C16.1
BOOT3
  Top 0.6: IC4.1 70.32,107.37 68.73,105.78 C25.1
GND  (via drill 0.5 pad 1)
  Top 0.3: IC10.9 125.44,77.78 IC10.EP
  Top 0.6: IC1.7 102.08,78.21 v102.44,78.58 | IC3.7 102.08,102.58 v102.44,102.58 | IC4.7 67.24,108.64 v67.24,108.28 | IC2.7 67.31,86.64 IC2.P$1
  other vias: 97.54,87.78 97.54,85.28 100.04,87.78 100.04,85.28 102.44,79.98 100.44,78.58 100.44,79.98 113.54,68.78 113.54,71.28 113.54,73.78 97.54,111.58 97.54,109.08 100.04,111.58 100.04,109.08 102.44,103.98 100.44,102.58 100.44,103.98 114.24,92.18 114.24,94.78 114.24,97.38 78.44,113.18 75.94,113.18 73.44,113.18 78.44,110.68 75.94,110.68 73.44,110.68 68.64,108.28 67.24,110.28 68.64,110.28 77.84,105.28 77.84,102.78 77.84,100.28 80.34,105.28 80.34,102.78 80.34,100.28 56.44,70.98 59.94,70.98 63.44,70.98 56.44,81.58 59.94,81.58 63.44,81.58 96.74,82.58 96.74,106.58 100.94,95.78 105.24,95.98 105.24,94.68 105.24,93.28 105.14,72.08 105.14,70.78 105.14,69.38 100.94,71.88 96.64,74.48 113.54,72.48 113.54,69.98 114.24,96.08 114.24,93.48 57.94,70.98 61.44,70.98 64.94,70.98 57.94,81.58 61.44,81.58 64.94,81.58 82.74,80.68 84.04,80.68 85.44,80.68 57.54,105.68 58.84,105.68 60.24,105.68 60.44,108.28 61.74,106.98 63.14,112.58 71.34,113.98 63.14,90.58 60.44,86.08 61.94,84.58 73.44,88.68 74.99,88.68 76.44,88.68 77.94,88.68 79.44,88.68 108.54,111.58 108.54,113.08 108.54,110.08 108.54,88.58 108.54,87.08 108.54,85.58 61.84,90.58 67.24,88.28 68.64,88.28 68.64,86.28 67.24,86.28 122.74,89.08 121.64,84.88 125.44,84.88 127.94,87.98 122.64,93.18 125.24,93.38 122.94,70.48 122.94,73.18 122.84,62.38 122.84,61.18 127.34,63.48 128.54,63.48 129.74,63.48 125.44,69.28 128.84,69.38 125.44,68.18 128.84,68.18 131.54,78.08 132.64,78.08 132.74,80.68 130.74,83.68 129.34,83.68 126.54,83.68 125.14,83.68 122.14,77.38 125.94,79.08 125.94,77.48 81.29,113.33 82.34,113.33 83.39,113.33 84.44,113.33 85.49,113.33 86.54,113.33
  pour Bottom: 51.44,114.88 114.94,114.88 arc-90 120.94,108.88 120.94,96.93 arc90 123.94,93.93 130.44,93.93 arc-90 133.44,90.93 133.44,66.38 arc-90 130.14,63.08 125.64,63.08 arc90 123.64,61.08 123.64,57.18 118.54,57.18 118.54,65.78 arc90 116.54,67.78 51.44,67.78
  pour Top (rank 2): 51.44,114.88 114.94,114.88 arc-90 120.94,108.88 120.94,96.93 arc90 123.94,93.93 130.44,93.93 arc-90 133.44,90.93 133.44,66.38 arc-90 130.14,63.08 125.64,63.08 arc90 123.64,61.08 123.64,59.18 arc-90 121.64,57.18 120.54,57.18 arc-90 118.54,59.18 118.54,65.78 arc90 116.54,67.78 51.44,67.78
N$1
  Top 0.4: IC1.4 99.54,81.28 R1.2
N$2
  Top 0.4: IC3.4 99.54,105.28 R9.2
N$3
  Top 0.4: IC1.6 100.81,74.64 99.31,74.64 R2.2 C6.2
N$4
  Top 0.4: C5.2 R2.1
N$5
  Top 0.4: R4.2 R3.1 99.54,77.28 IC1.5
N$6
  Top 0.4: IC3.6 100.81,98.4 C21.2 R10.2
N$7
  Top 0.6: IC2.1 71.17,85.37 C10.1
N$8
  pour Top (no thermals): 64.24,85.58 66.04,85.58 66.86,84.76 arc45 68.27,84.18 69.94,84.18 69.94,83.28 72.78,80.44 arc45 76.31,78.98 83.44,78.98 arc-90 85.44,76.98 85.44,75.78 arc-90 83.44,73.78 77.41,73.78 arc-45 73.88,75.24 64.24,84.88
N$9
  Top 0.2: R5.2 70.14,89.18 IC2.4
N$10
  Top 0.2: C15.2 R6.2 63.17,87.88 63.2,87.91 IC2.6
N$11
  Top 0.2: C14.2 R6.1
N$12
  Top 0.2: R8.2 R17.2 R7.1 65.64,89.16 65.62,89.18 IC2.5
N$13
  Top 0.4: C20.2 R10.1
N$14
  Top 0.4: IC4.4 69.94,111.18 R13.2
N$15
  Top 0.4: R12.2 R11.1 99.54,101.28 IC3.5
N$16
  Top 0.4: IC4.6 63.3,109.91 R14.2 C35.2
N$17
  Top 0.4: C34.2 R14.1
N$18
  Top 0.4: R16.2 R15.1 65.94,111.18 IC4.5
N$19  (via drill 0.5 pad 1)
  Top 0.3: IC5.4 126.19,91.78 127.13,91.78 arc-45 v127.83,91.48 v127.84,91.48
  Bottom 0.3: R18.S2 137.14,90.78 arc90 136.14,91.78 128.56,91.78 arc45 v127.85,91.48 v127.84,91.48
N$20
  Top 0.3: C62.1 130.16,80.47 arc-45 129.81,80.33 129.64,80.33 arc90 129.24,79.93 129.24,78.98 arc-90 129.04,78.78 IC10.4
N$21  (via drill 0.5 pad 1)
  Top 0.3: IC5.3 126.29,89.68 126.29,89.98 arc-90 126.79,90.48 127.79,90.48 arc90 128.79,91.48 128.79,91.83 arc90 v127.84,92.78
  Bottom 0.3: R18.S1 137.14,93.48 arc-90 136.14,92.48 128.56,92.48 arc-45 v127.85,92.77 v127.84,92.78
N$22
  Top 0.5: R21.1 R22.2
N$38
  Top 0.3: IC10.8 122.84,78.28 arc-90 122.04,79.08 122.04,81.05 C87.1 123.74,82.45 R29.2
N$39
  Top 0.3: IC10.5 128.74,79.28 128.74,80.35 arc-45 128.89,80.7 129.24,81.05 R25.2
N$50
  Top 0.3: C88.1 R29.1
PGND
  pour Top (rank 4, no thermals): 123.92,151.55 47.97,151.55 arc60 39.3,146.55 1.33,80.78 arc60 1.33,70.78 39.3,5 arc60 47.97,0 49.09,0 arc90 52.09,3 52.09,27.88 arc-90 53.09,28.88 146.37,28.88 170.55,70.78 arc60 170.55,80.78 132.58,146.55 arc60
PH
  pour Top (no thermals): 123.09,77.33 124.19,77.33 125.34,76.18 126.44,76.18 126.44,75.68 arc90 127.84,74.28 134.34,74.28 134.34,64.48 131.54,64.48 131.54,68.38 123.09,76.83
PWRSW
  Top 0.3: D5.3 71.52,53.53 arc90 72.02,54.03 72.02,54.05 R24.1 | R23.2 72.07,55.3 71.92,55.45 arc-45 71.04,57.57 71.04,64.83 arc90 69.04,66.83 64.36,66.83 arc-45 62.24,67.71 CON3.2
  Top 0.5: 53.66,53.78 46.91,53.78 arc90 45.91,52.78 45.91,52.23 Q3.G | Q2.G 53.66,53.78 | R23.2 R24.1 | D5.3 68.62,53.78 61.66,53.78 | 53.66,53.78 61.66,53.78 | Q1.G 61.66,53.78
SW1
  pour Top (no thermals): 103.14,75.58 103.14,77.38 104.54,78.78 111.94,78.78 arc-90 113.04,77.68 113.04,75.58 112.44,75.58 arc90 110.44,73.58 110.44,69.18 106.64,69.18 106.64,73.58 arc90 104.64,75.58
SW2
  pour Top (no thermals): 103.14,99.58 103.14,101.38 104.54,102.78 111.94,102.78 arc-90 113.04,101.68 113.04,99.58 112.44,99.58 arc90 110.44,97.58 110.44,92.68 106.64,92.68 106.64,97.58 arc90 104.64,99.58
SW3
  pour Top (no thermals): 64.24,107.58 66.04,107.58 67.44,106.18 67.44,98.98 arc-90 65.44,96.98 57.44,96.98 57.44,98.78 63.66,104.99 arc45 64.24,106.41
VBAT  (via drill 0.5 pad 1)
  Top 0.3: R23.1 v72.32,57.93 | IC10.2 129.64,77.78
  Top 0.5: R21.2 129.37,85.98 133.59,85.98 arc-90 v134.34,85.23
  Top 0.6: IC2.2 73.84,86.64 C13.P$2 | IC4.2 73.36,108.64 C33.P$2 | IC3.2 102.08,108.99 C19.P$2 | IC1.2 102.08,85.19 C4.P$2
  Top 1: C44.P$2 v135.39,76.23
  Top 1.5: C13.P$2 C12.P$2 C11.P$2 92.94,86.93 | C4.P$2 C3.P$2 | C3.P$2 C2.P$2 | C3.P$2 101.99,88.08 arc90 99.99,90.08 93.24,90.08 | C17.P$2 C18.P$2 | C19.P$2 C18.P$2 | C18.P$2 101.99,112.18 arc90 100.04,114.13 92.79,114.13 | C33.P$2 C27.P$2 C26.P$2 91.44,108.73
  Bottom 0.3: v134.39,76.23 v135.39,76.23
  other vias: 89.09,116.18 90.14,116.18 91.19,116.18 92.24,116.18 93.29,116.18
  pour Top: 88.54,116.58 95.34,116.58 95.34,88.28 arc-90 93.34,86.28 88.54,86.28
  pour Bottom (rank 3, no thermals): 123.92,151.55 47.97,151.55 arc60 39.3,146.55 1.33,80.78 arc60 1.33,70.78 39.3,5 arc60 47.97,0 49.09,0 arc90 52.09,3 52.09,27.88 arc-90 53.09,28.88 146.37,28.88 170.55,70.78 arc60 170.55,80.78 132.58,146.55 arc60
  pour Top (no thermals): 133.44,76.58 131.66,76.58 arc-45 130.95,76.87 129.99,77.83 127.54,77.83 127.54,77.68 128.99,77.68 arc-90 129.64,77.03 129.64,75.88 133.44,75.88
VDC
  pour Bottom (rank 2, no thermals): 108.3,135.78 87.54,135.78 arc90 85.54,133.78 85.54,132.78 arc-90 83.54,130.78 45.94,130.78 arc90 42.84,127.68 42.84,118.78 arc90 44.04,117.58 114.54,117.58 arc-90 121.44,110.68 121.44,99.78 arc90 126.44,94.78 140.44,94.78 140.44,103.28 arc90 138.44,105.28 134.44,105.28 arc-90 131.44,108.28 131.44,112.64 arc45 128.51,119.71 115.37,132.85 arc45
VDD_4V  (via drill 0.5 pad 1)
  Top 0.2: R27.2 v127.94,83.68
  Bottom 0.2: v127.94,83.68 127.94,67.81 arc-45 127.36,66.39 v126.54,65.58
  pour Top (no thermals): 129.34,64.48 122.14,64.48 arc90 121.14,63.48 arc-90 120.14,62.48 119.74,62.48 arc-90 118.74,63.48 118.74,66.18 arc-90 119.74,67.18 121.14,67.18 arc90 122.14,68.18 122.14,69.18 123.74,69.18 123.74,68.18 arc90 124.74,67.18 129.34,67.18
VDD_5V  (via drill 0.5 pad 1)
  Top 0.3: R11.2 96.72,99.98 v96.74,99.98
  Bottom 0.3: v96.74,99.98 v115.74,99.98
  pour Top (no thermals): 109.94,109.88 109.94,105.98 111.74,105.98 arc-90 115.44,102.28 115.44,91.68 117.34,91.68 arc90 118.34,92.68 118.34,96.29 arc-90 119.34,97.29 119.64,97.29 arc90 120.64,98.29 120.64,103.38 arc90 114.14,109.88
VDD_12V  (via drill 0.5 pad 1)
  Top 0.3: R15.2 65.92,113.98 v64.54,113.98
  Bottom 0.3: v71.74,105.48 71.74,107.18 arc90 64.94,113.98 v64.54,113.98
  pour Top (no thermals): 76.34,105.98 71.24,105.98 71.24,98.98 arc-90 68.24,95.98 54.64,95.98 arc-90 53.24,97.38 51.84,97.38 arc90 51.14,96.68 51.14,90.58 53.24,90.58 53.24,92.28 arc-90 54.74,93.78 73.34,93.78 arc90 76.34,96.78
VDD_24V
  Top 0.3: R7.2 65.54,91.9 62.24,91.9 arc90 60.34,90 60.34,88.98 arc-45 59.56,87.1 52.97,80.51
  pour Top (no thermals): 68.84,78.68 55.54,78.68 arc-90 53.94,80.28 arc90 52.74,81.48 51.84,81.48 arc90 51.14,80.78 51.14,73.88 68.84,73.88
VSENSE
  Top 0.3: R27.1 R28.2 126.24,81.05 126.24,80.68 arc-90 125.74,80.18 122.94,80.18 arc90 122.54,79.78 122.54,79.18 arc90 122.94,78.78 IC10.7

### Text on the board
tPlace: - | + | + | - | - | + | Pegas V3 / Power PCB / December 2022 | + | - | - | - | + | 12V | - | + | - | Payload / power | + | + | - | 24V | + | + | - | + | + | - | - | - | + | + | - | Connect et non queri | - | +
bPlace: Pads marked with shortdash lines / should be connected with 16AWG wire